# Altium schematic sheet Peripherals.SchDoc
size A4; SheetNumber: 1; SheetTotal: 2
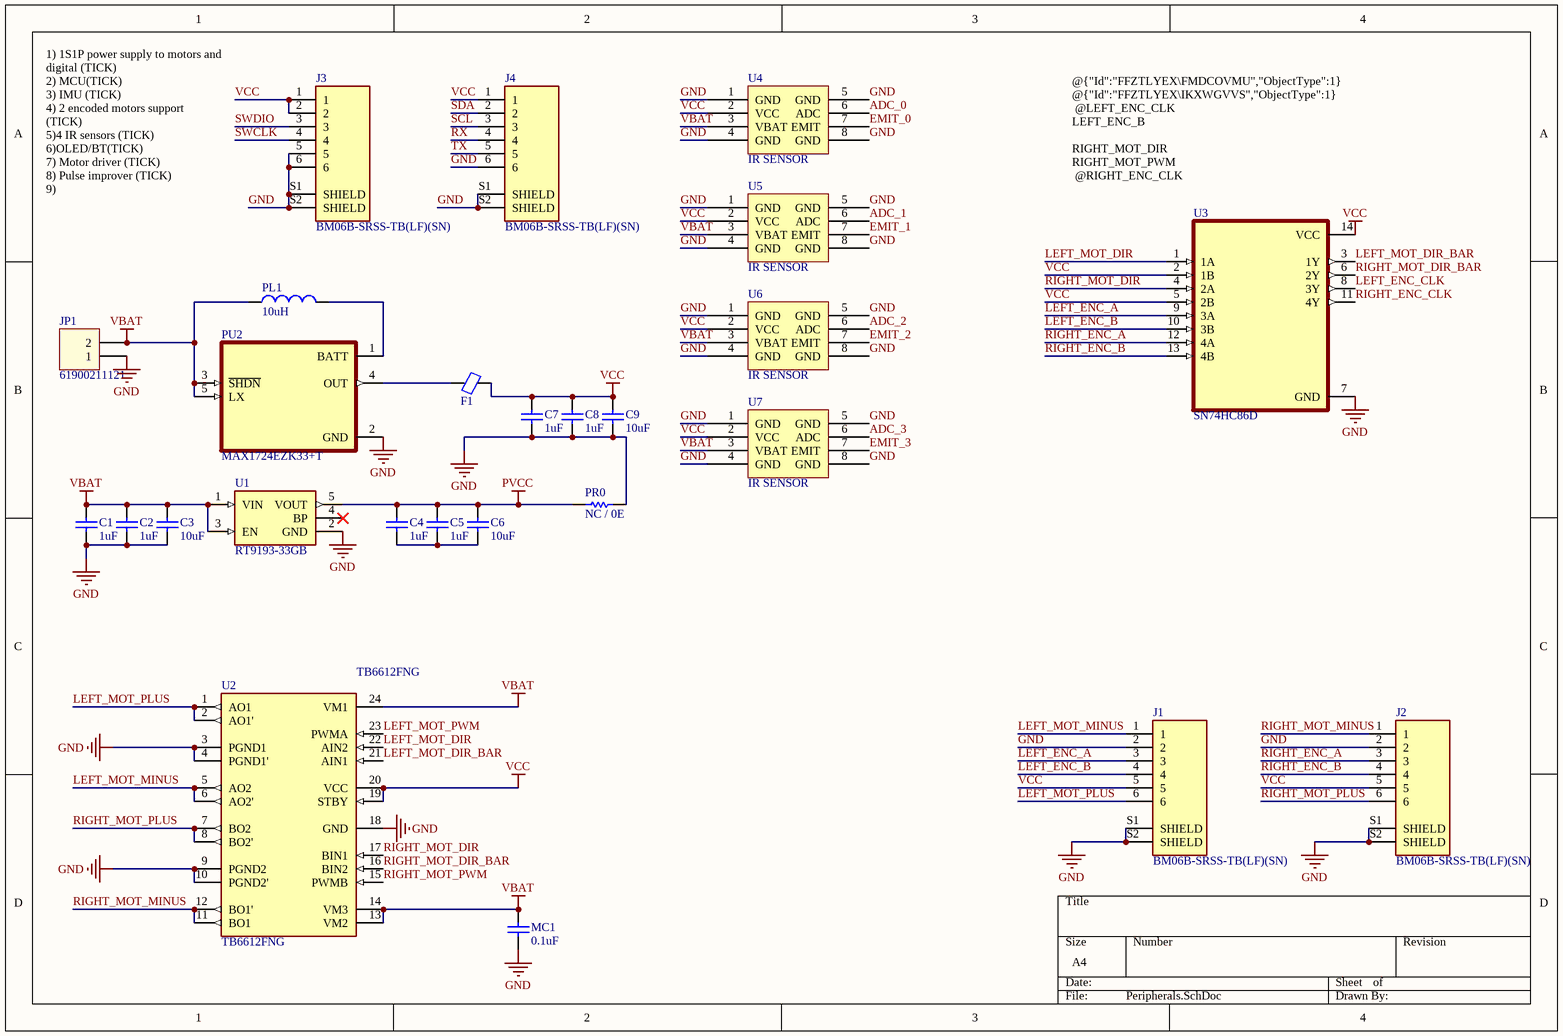
[diagram p0: Peripherals.SchDoc]

## Parts
C1  1uF  [CAP0603]
C2  1uF  [CAP0603]
C3  10uF  [CAP0603]
C4  1uF  [CAP0603]
C5  1uF  [CAP0603]
C6  10uF  [CAP0603]
C7  1uF  [CAP0603]
C8  1uF  [CAP0603]
C9  10uF  [CAP0603]
F1  Ferrite Bead SMD  [FB0603]  (value not drawn)
J1  BM06B-SRSS-TB(LF)(SN)  [JST_BM06B-SRSS-TB(LF)(SN)]
J2  BM06B-SRSS-TB(LF)(SN)  [JST_BM06B-SRSS-TB(LF)(SN)]
J3  BM06B-SRSS-TB(LF)(SN)  [JST_BM06B-SRSS-TB(LF)(SN)]
J4  BM06B-SRSS-TB(LF)(SN)  [JST_BM06B-SRSS-TB(LF)(SN)]
JP1  61900211121  [61900211121]
MC1  0.1uF  [Cap1206_(3216X18L)Size A]
PL1  10uH  [IND0805]
PR0  NC / 0E  [RESC3413X04N]
PU2  MAX1724EZK33+T  [SOT95P275X110-5N]
U1  RT9193-33GB  [SOT94P279X129-5N]
U2  TB6612FNG  [SSOP24]
U3  SN74HC86D  [SOIC127P600X175-14N]
U4  IR SENSOR  [BLASTER]
U5  IR SENSOR  [BLASTER]
U6  IR SENSOR  [BLASTER]
U7  IR SENSOR  [BLASTER]

## Nets
GND: C1.1 C2.1 C3.1 C7.1 C8.1 C9.1 J1.2 J1.S1(SHIELD) J1.S2(SHIELD) J2.2 J2.S1(SHIELD) J2.S2(SHIELD) J3.5 J3.6 J3.S1(SHIELD) J3.S2(SHIELD) J4.6 J4.S1(SHIELD) J4.S2(SHIELD) JP1.1 MC1.1 PR0.2 PU2.2(GND) U1.2(GND) U2.3(PGND1) U2.4(PGND1') U2.9(PGND2) U2.10(PGND2') U2.18(GND) U3.7(GND) U4.1(GND) U4.4(GND) U4.5(GND) U4.8(GND) U5.1(GND) U5.4(GND) U5.5(GND) U5.8(GND) U6.1(GND) U6.4(GND) U6.5(GND) U6.8(GND) U7.1(GND) U7.4(GND) U7.5(GND) U7.8(GND)
PVCC: C4.2 C5.2 C6.2 PR0.1 U1.5(VOUT)
VBAT: C1.2 C2.2 C3.2 JP1.2 MC1.2 PL1.1 PU2.3(~{SHDN}) PU2.5(LX) U1.1(VIN) U1.3(EN) U2.13(VM2) U2.14(VM3) U2.24(VM1) U4.3(VBAT) U5.3(VBAT) U6.3(VBAT) U7.3(VBAT)
VCC: C7.2 C8.2 C9.2 F1.2 J1.5 J2.5 J3.1 J3.2 J4.1 U2.19(STBY) U2.20(VCC) U3.2(1B) U3.5(2B) U3.14(VCC) U4.2(VCC) U5.2(VCC) U6.2(VCC) U7.2(VCC)
ADC_0: U4.6(ADC)
ADC_1: U5.6(ADC)
ADC_2: U6.6(ADC)
ADC_3: U7.6(ADC)
EMIT_0: U4.7(EMIT)
EMIT_1: U5.7(EMIT)
EMIT_2: U6.7(EMIT)
EMIT_3: U7.7(EMIT)
LEFT_ENC_A: J1.3 U3.9(3A)
LEFT_ENC_B: J1.4 U3.10(3B)
LEFT_ENC_CLK: U3.8(3Y)
LEFT_MOT_DIR: U2.22(AIN2) U3.1(1A)
LEFT_MOT_DIR_BAR: U2.21(AIN1) U3.3(1Y)
LEFT_MOT_MINUS: J1.1 U2.5(AO2) U2.6(AO2')
LEFT_MOT_PLUS: J1.6 U2.1(AO1) U2.2(AO1')
LEFT_MOT_PWM: U2.23(PWMA)
RIGHT_ENC_A: J2.3 U3.12(4A)
RIGHT_ENC_B: J2.4 U3.13(4B)
RIGHT_ENC_CLK: U3.11(4Y)
RIGHT_MOT_DIR: U2.17(BIN1) U3.4(2A)
RIGHT_MOT_DIR_BAR: U2.16(BIN2) U3.6(2Y)
RIGHT_MOT_MINUS: J2.1 U2.11(BO1) U2.12(BO1')
RIGHT_MOT_PLUS: J2.6 U2.7(BO2) U2.8(BO2')
RIGHT_MOT_PWM: U2.15(PWMB)
RX: J4.4
SCL: J4.3
SDA: J4.2
SWCLK: J3.4
SWDIO: J3.3
TX: J4.5
NetC4_1: C4.1 C5.1 C6.1
NetF1_1: F1.1 PU2.4(OUT)
NetPL1_2: PL1.2 PU2.1(BATT)

Not connected (* = marked no-connect by the designer): U1 4(BP)*

## Notes on the sheet
- @{"Id":"FFZTLYEX\FMDCOVMU","ObjectType":1}
  @{"Id":"FFZTLYEX\IKXWGVVS","ObjectType":1}
  @LEFT_ENC_CLK
  LEFT_ENC_B
  RIGHT_MOT_DIR
  RIGHT_MOT_PWM
  @RIGHT_ENC_CLK
  @{"Id":"FFZTLYEX\EYWVHBRG","ObjectType":1}
- 1) 1S1P power supply to motors and digital (TICK)
  2) MCU(TICK)
  3) IMU (TICK)
  4) 2 encoded motors support (TICK)
  5)4 IR sensors (TICK)
  6)OLED/BT(TICK)
  7) Motor driver (TICK)
  8) Pulse improver (TICK)
  9)

## Library data of the parts
C1-C9 = CAP SMD PACKAGE: 0603 CAPACITOR SMD; Designer: Abbas Basereh; Desc.: CAP SMD TOTAL PACKAGES; VALUE: 100nF; Data: 2017-3-10
F1 = Ferrite Bead SMD Package: 0603 FERRITE; Designer: Ali Hafizi
JP1 = 61900211121: WR-WTB 2.54mm Male Locking Header, 2p; Pin Number: 2; ComponentLink1Description: Manufacturer; ComponentLink1URL: http://www.we-online.de; ComponentLink2Description: Datasheet; ComponentLink2URL: http://katalog.we-online.de/em/datasheet/6190xx11121.pdf; Part Number: 61900211121; Published Date: June 2017; Publisher: Wurth Elektronik; Pitch: 2.54 mm
MC1 = CAP SMD PACKAGE: TOTAL CAPACITOR SMD PACK; Designer: Abbas Basereh; Desc.: CAP SMD TOTAL PACKAGES; VALUE: 100nF; Data: 2017-3-10
PL1 = INDUCTOR SMD PACKAGE: TOTAL INDUCTOR SMD PACK; Designer: Abbas Basereh; Desc.: INDUCTOR  SMD TOTAL PACKAGES; VALUE: 1u; Data: 2017-3-10
PR0 = RES 0805 0.125W: RES 0805; Designer: Abbas Basereh; Desc.: RES SMD 0805; Data: 16-12-2016
PU2 = MAX1724EZK33+T: Boost Switching Regulator IC Positive Fixed 3.3V 1 Output 400mA _Switch_ SOT-23-5 Thin, TSOT-23-5; MF: Maxim Integrated; Value: *; SnapEDA_Link: https://www.snapeda.com/parts/MAX1724EZK33%2BT/Maxim%20Integrated/view-part/571456/?ref=snap; Package: SOT-23-5 Maxim; MP: MAX1724EZK33+T; Availability: Unavailable; Price: None
U1 = RT9193-33GB: Linear Voltage Regulator IC Positive Fixed 1 Output 300mA TSOT-23-5; MF: Richtek USA; SnapEDA_Link: https://www.snapeda.com/parts/RT9193-33GB/Richtek+USA+Inc./view-part/?ref=snap; Package: SOT-23-5 Richtek; MP: RT9193-33GB; Check_prices: https://www.snapeda.com/parts/RT9193-33GB/Richtek+USA+Inc./view-part/?ref=eda; Purchase-URL: https://pricing.snapeda.com/search/part/RT9193-33GB/?ref=eda; Digi-Key_Part_Number: 1028-1014-2-ND; Value: *
U2 = TB6612FNG: - Motor Driver Power MOSFET Parallel 24-SSOP; MF: Toshiba; SnapEDA_Link: https://www.snapeda.com/parts/TB6612FNG/Toshiba/view-part/?ref=snap; Package: None; Value: *; MP: TB6612FNG; Check_prices: https://www.snapeda.com/parts/TB6612FNG/Toshiba/view-part/?ref=eda
U3 = SN74HC86D: Quadruple 2-Input Exclusive-OR Gates 14-SOIC -40 to 85; MF: Texas Instruments; Package: SOIC-14 Texas Instruments; Digi-Key_Part_Number: 2156-SN74HC86DRE4-ND; Check_prices: https://www.snapeda.com/parts/SN74HC86D/Texas%20Instruments/view-part/249677/?ref=eda; Purchase-URL: https://pricing.snapeda.com/search/part/SN74HC86D/?ref=eda; SnapEDA_Link: https://www.snapeda.com/parts/SN74HC86D/Texas%20Instruments/view-part/249677/?ref=snap; Value: *; MP: SN74HC86D
U4-U7 = Blaster
J1-J4 = BM06B-SRSS-TB(LF)(SN): Package: None; Price: None; Value: *; MP: BM06B-SRSS-TB(LF)(SN); Availability: Unavailable